# EAGLE schematic Prism_connection_diagram (EAGLE 9.3.1)
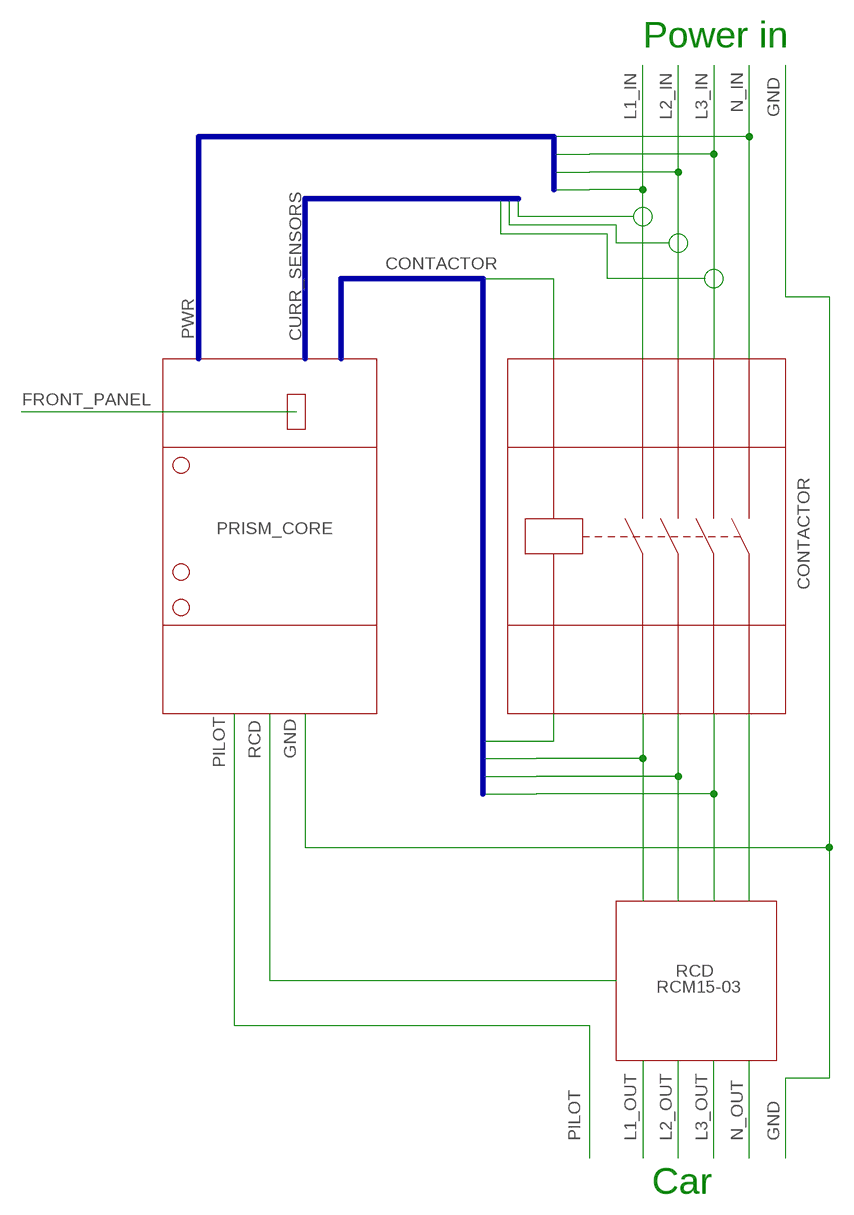
[diagram p0: schematic, sheet 1]

## Parts
CONTACTOR  CONTACTORS  [PRISM_CORE]
PRISM_CORE  PRISM_CORE  [PRISM_CORE]
RCD  RCM15-03  RCD  [RCD]

## Nets
CONTACTOR: CONTACTOR.P1 PRISM_CORE.P1
CURR_SENSORS: PRISM_CORE.P2
FRONT_PANEL: PRISM_CORE.P11
GND: PRISM_CORE.P9
L1_IN: CONTACTOR.P9
L1_OUT: CONTACTOR.P10 CONTACTOR.P11(P10)
L2_IN: CONTACTOR.P2
L2_OUT: CONTACTOR.P6
L3_IN: CONTACTOR.P3
L3_OUT: CONTACTOR.P7
N$2: CONTACTOR.P5
N_IN: CONTACTOR.P4
N_OUT: CONTACTOR.P8
PILOT: PRISM_CORE.P7
PWR: PRISM_CORE.P5
RCD: PRISM_CORE.P8 RCD.P0(P1)
Unconnected: PRISM_CORE.P3 PRISM_CORE.P4 PRISM_CORE.P6 PRISM_CORE.P10

## Buses
CONTACTOR,CURR_SENSORS,FRONT_PANEL,L1_IN,L1_OUT,L2_IN,L2_OUT,L3_IN,L3_OUT,N$1,N$2,N$3,N$4,N_IN,N_OUT,PWR,RCD,SD,USB
PWR
CONTACTOR,CURR_SENSORS,FRONT_PANEL,GND,L1_IN,L1_OUT,L2_IN,L2_OUT,L3_IN,L3_OUT,N$1,N$2,N$3,N$4,N$5,N$6,N$7,N$8,N$10,N$11,N_IN,N_OUT,PILOT,PWR,RCD

## Notes on the sheet
- Power in
- Car

## Library data of the parts
CONTACTOR = Prism:CONTACTORS
PRISM_CORE = Prism:PRISM_CORE
RCD = Prism:RCD